# EAGLE design LCD_Rev-4 (EAGLE 6.4)
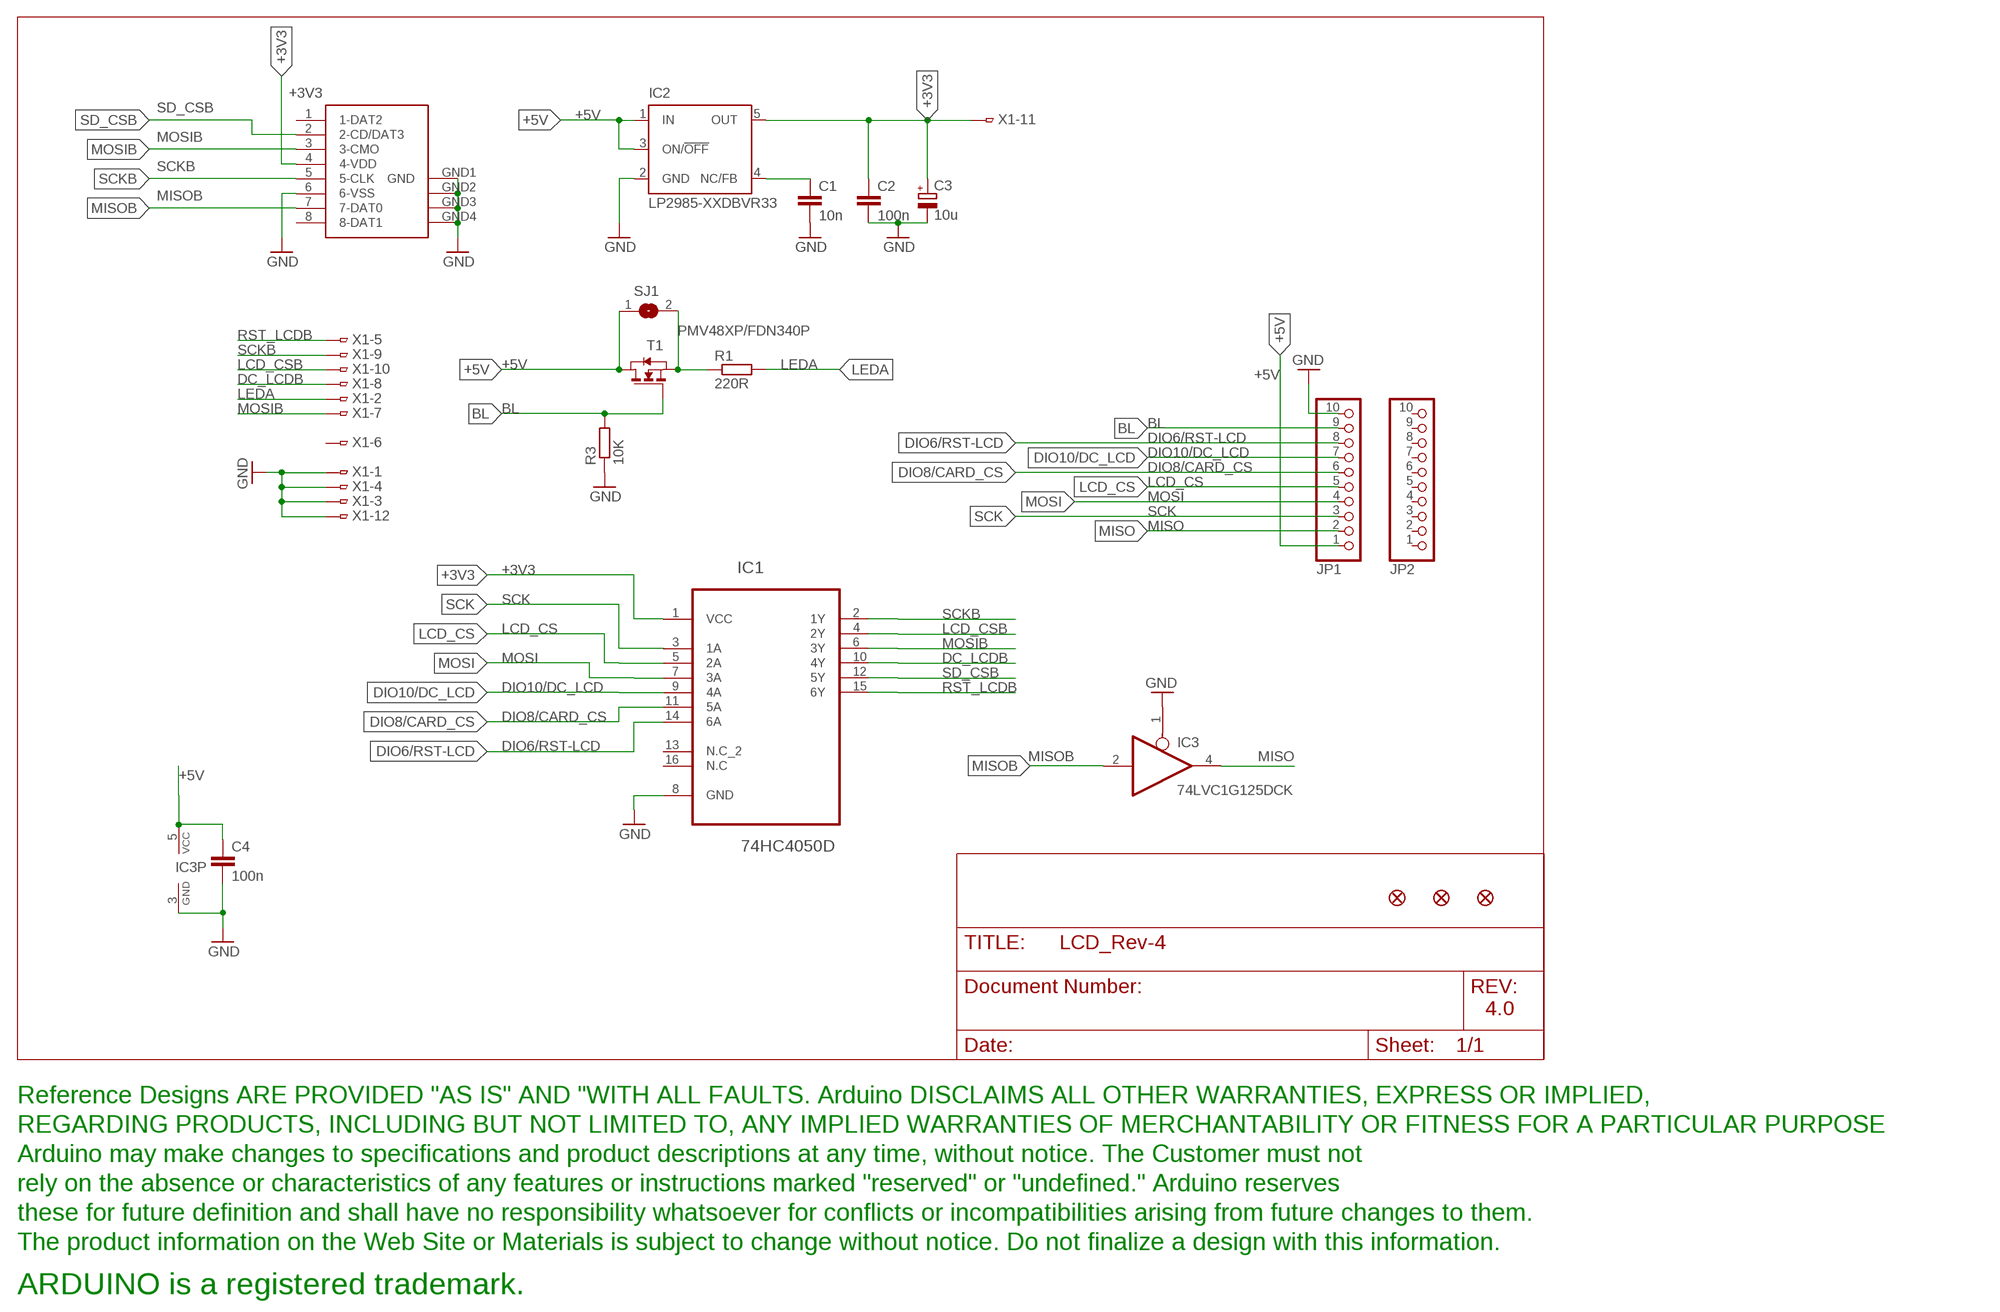
[diagram p0: schematic, sheet 1]

## Parts
C1  10n  C-EUC0603  [C0603-ROUND]
C2  100n  C-EUC0603  [C0603-ROUND]
C3  10u  CPOL-EUSMCB  [SMC_B]
C4  100n  C-EUC0603  [C0603-ROUND]
IC1  74HC4050D  [SOIC127P600X175-16N]
IC2  LP2985-XXDBVR33  [SOT23-DBV]
IC3  74LVC1G125DCK  [SC70-5]
JP1  PINHD-1X10TH  [1X10-TH]
JP2  PINHD-1X10TH  [1X10-TH]
R1  220R  R-EU_0603-RND  [R0603-ROUND]
R3  10K  R-EU_0603-RND  [R0603-ROUND]
SJ1  SJL  [SJL]
T1  PMV48XP/FDN340P  NMOSSOT23  [SOT-23]
U1  SDCARD-15TW-8821  [SDCARD-15TW-8821]
U$1  FIDUCIAL-LITTLE1X2  [FIDUCIAL-1X2]
U$2  DISCLAIMER  [DISCLAIMER]
U$3  FIDUCIAL-LITTLE1X2  [FIDUCIAL-1X2]
U$4  FIDUCIAL-LITTLE1X2  [FIDUCIAL-1X2]
X1  FH12-12S-0.8SH  [FH12-12S-0.8SH]

## Nets
+3V3: C2.1 C3.+ IC1.1(VCC) IC2.5(OUT) U1.4(4-VDD) X1.11
+5V: C4.1 IC2.1(IN) IC2.3(ON/!OFF) IC3.5(VCC) JP1.1 SJ1.1 T1.1(D)
BL: JP1.9 R3.2 T1.3(G)
DC_LCDB: IC1.10(4Y) X1.8
DIO6/RST-LCD: IC1.14(6A) JP1.8
DIO8/CARD_CS: IC1.11(5A) JP1.6
DIO10/DC_LCD: IC1.9(4A) JP1.7
GND: C1.2 C2.2 C3.- C4.2 IC1.8(GND) IC2.2(GND) IC3.1(OE) IC3.3(GND) JP1.10 R3.1 U1.6(6-VSS) U1.GND1(GND) U1.GND2(GND1) U1.GND3(GND2) U1.GND4(GND3) X1.1 X1.3 X1.4 X1.12
LCD_CS: IC1.5(2A) JP1.5
LCD_CSB: IC1.4(2Y) X1.10
LEDA: R1.2 X1.2
MISO: IC3.4(O) JP1.2
MISOB: IC3.2(I) U1.7(7-DAT0)
MOSI: IC1.7(3A) JP1.4
MOSIB: IC1.6(3Y) U1.3(3-CMO) X1.7
N$1: C1.1 IC2.4(NC/FB)
N$2: R1.1 SJ1.2 T1.2(S)
RST_LCDB: IC1.15(6Y) X1.5
SCK: IC1.3(1A) JP1.3
SCKB: IC1.2(1Y) U1.5(5-CLK) X1.9
SD_CSB: IC1.12(5Y) U1.2(2-CD/DAT3)
Unconnected: IC1.13(N.C_2) IC1.16(N.C) JP2.1 JP2.2 JP2.3 JP2.4 JP2.5 JP2.6 JP2.7 JP2.8 JP2.9 JP2.10 U1.1(1-DAT2) U1.8(8-DAT1) X1.6

## Notes on the sheet
- 4.0

## Library data of the parts
C1 C2 C4 = Smartprj:C-EU: CAPACITOR, European symbol
C3 = Smartprj:CPOL-EU: POLARIZED CAPACITOR, European symbol
IC1 = Smartprj:74HC4050D: Hex high-to-low level shifter; MPN: 74HC4050D; OC_FARNELL: 1085272; OC_NEWARK: -; PACKAGE: SOIC-16; SUPPLIER: NXP
IC2 = Smartprj:LP2985-XXDBVR: ULTRALOW-POWER 50-mA LOW-DROPOUT LINEAR REGULATORS 50-mA Low-Dropout Regulator Source: http://focus.ti.com/lit/ds/symlink/tps77001.pdf
IC3 = 74xx-little-us:74*1G125: Single Bus Buffer Gate with 3-State Output
JP1 JP2 = Smartprj:PINHD-1X10: PIN HEADER
R1 R3 = Smartprj:R-EU_: RESISTOR, European symbol
SJ1 = Smartprj:SJ: SMD solder JUMPER
T1 = zetex:NMOSSOT23: MOS FET; OC_FARNELL: unknown; OC_NEWARK: unknown
U1 = st-mod v1.4:SDCARD-15TW-8821: SD Card SDCARD 15TW 8821
U$1 U$3 U$4 = Smartprj:FIDUCIAL-LITTLE: Fiducial Alignment Points Various fiducial points for machine vision alignment.
U$2 = Smartprj:DISCLAIMER
X1 = Smartprj:FH12-12S-0.8S: 0.5mm Pitch Connectors For FPC/FFC Source: Data sheet <http://www.hirose.co.jp/cataloge_hp/e58605370.pdf>; MPN: MC34827; OC_FARNELL: 1324544; OC_NEWARK: 41P0493

## Board
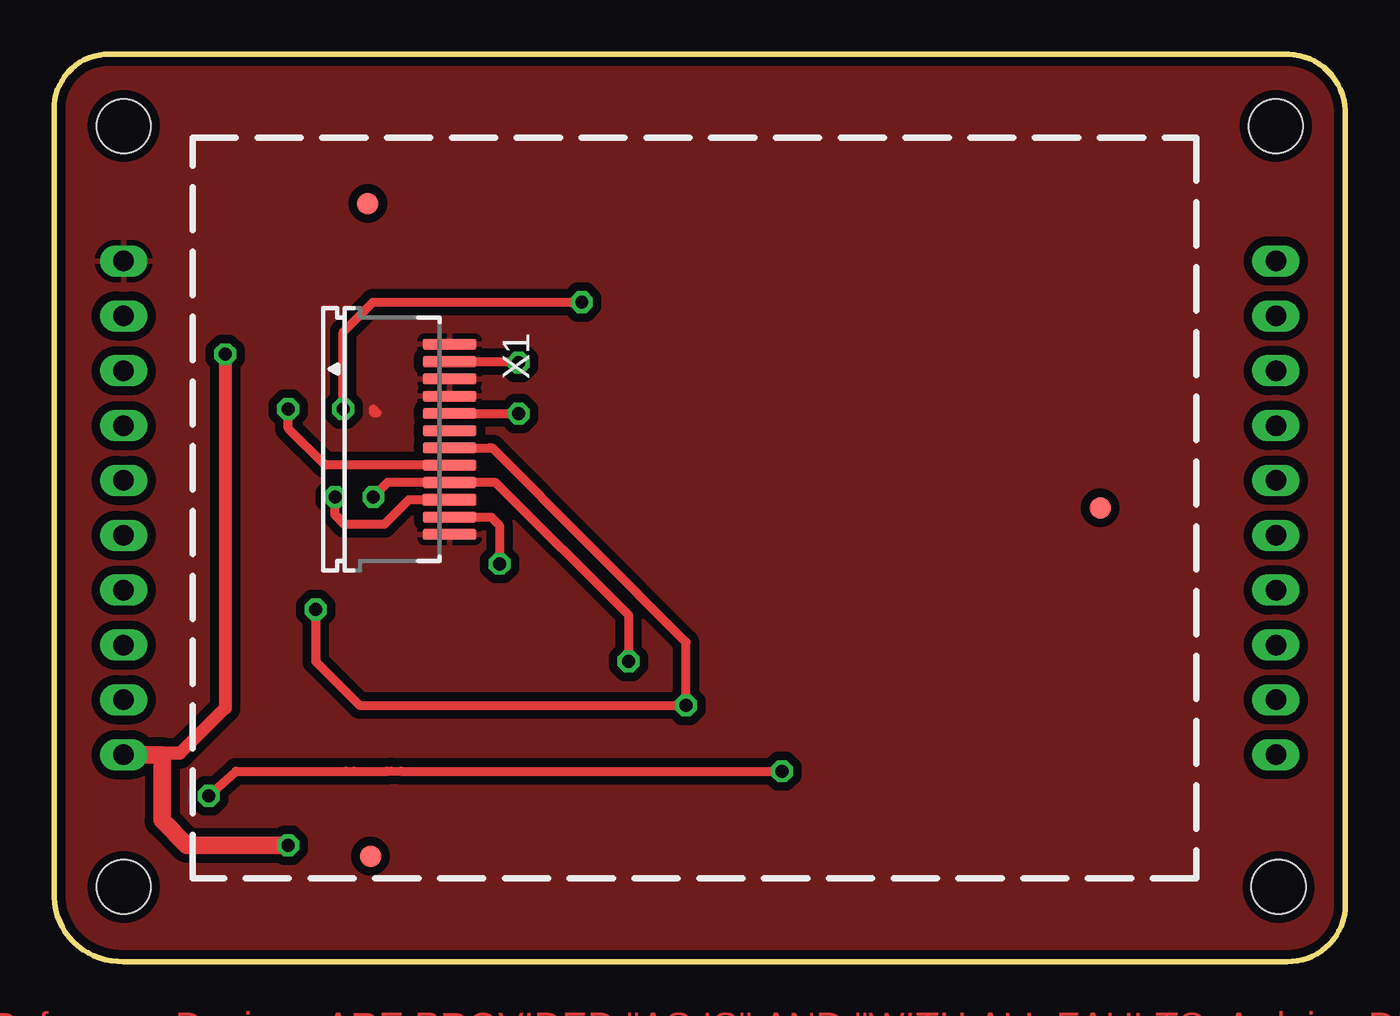
[diagram p1: board, top side]
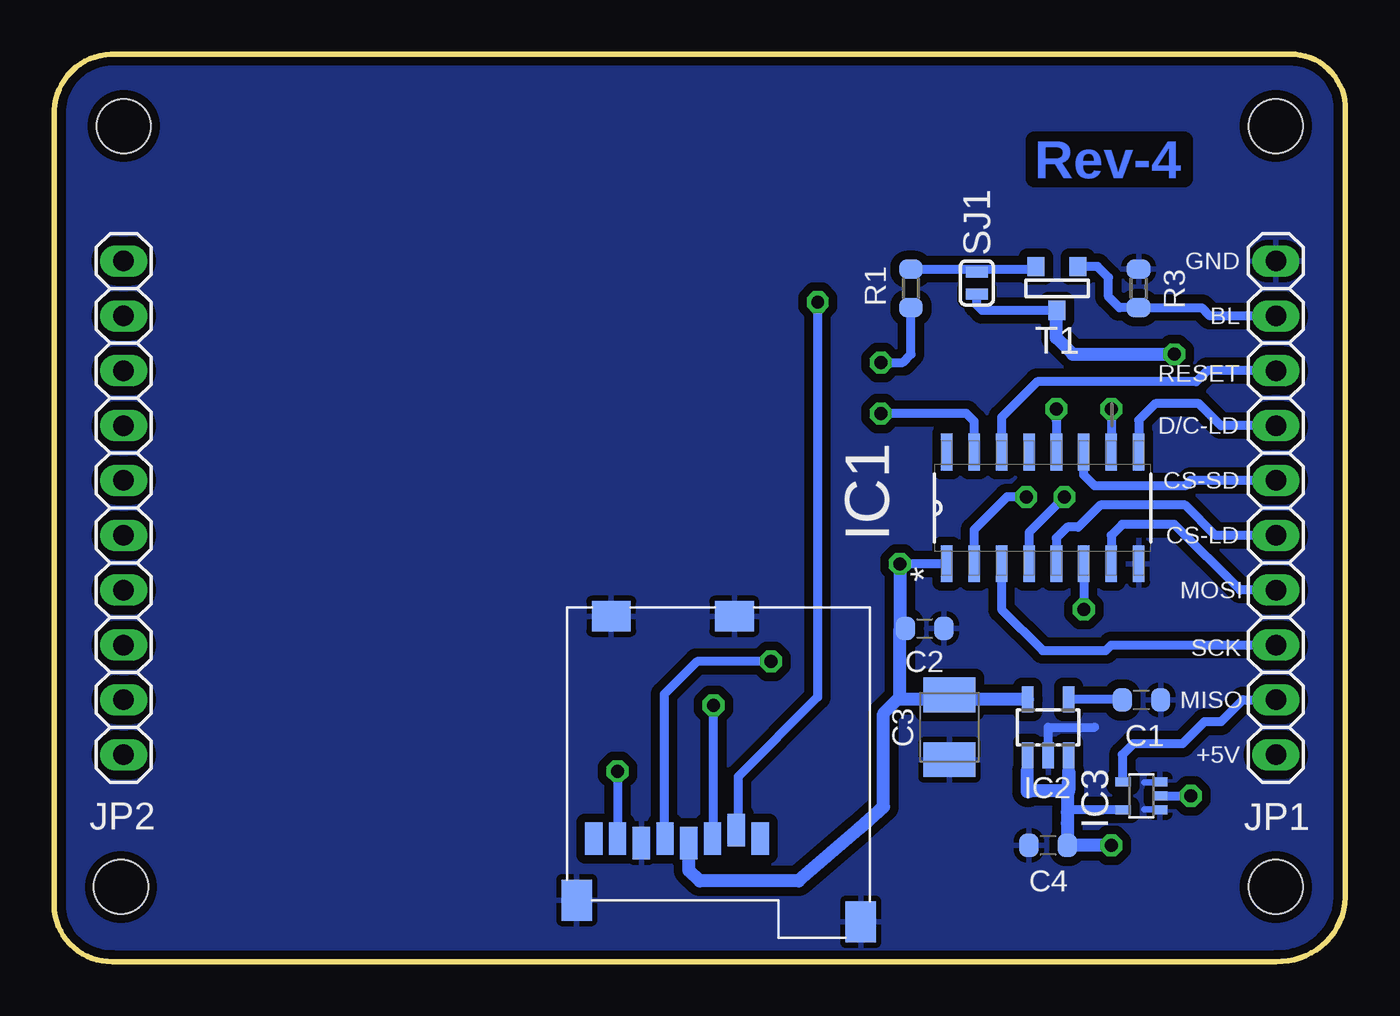
[diagram p2: board, bottom side, seen from below]

Size 59.79 x 42.02 mm. Coordinates in mm from the lower left corner, seen from the top.
Outline: 59.79,2.59 arc-90 57.07,0 3.23,0 arc-90 0,2.97 0,39.67 arc-90 2.79,42.01 56.9,42.01 arc-90 59.79,39.42 59.79,2.59
Copper layers (1*16): Top 0.035mm / dielectric 1.5mm / Bottom 0.035mm
Design rules "default": minimum track width 10mil, minimum drill 23mil, track to track 8mil, track to pad 8mil, pad to pad 8mil, via to via 8mil, smd to smd 8mil, copper to edge 8mil, drill to drill 8mil, minimum pad ring 10mil, minimum via ring 8mil, stop-mask expansion 4mil, vias tented up to drill 31mil, thermal gap 10mil
Holes 2.5 mm at 3.23,38.68 56.69,3.45 3.23,3.45 56.57,38.68

### Footprints (pad centres in the part's own frame; a part is rotated, then mirrored left to right if it is on the bottom)
C0603-ROUND = smd 0.898 x 1.1: 1 -0.889,0; 2 0.889,0
SMC_B = smd 1.6 x 2.4: + -1.5,0; - 1.5,0
SOIC127P600X175-16N = smd 1.702 x 0.533: 1 -2.591,4.445; 2 -2.591,3.175; 3 -2.591,1.905; 4 -2.591,0.635; 5 -2.591,-0.635; 6 -2.591,-1.905; 7 -2.591,-3.175; 8 -2.591,-4.445; 9 2.591,-4.445; 10 2.591,-3.175; 11 2.591,-1.905; 12 2.591,-0.635; 13 2.591,0.635; 14 2.591,1.905; 15 2.591,3.175; 16 2.591,4.445
SOT23-DBV = smd 0.55 x 1.2: 1 -0.95,-1.3; 2 0,-1.3; 3 0.95,-1.3; 4 0.95,1.3; 5 -0.95,1.3
SC70-5 = smd 0.4 x 0.7: 1 -0.65,-0.85; 2 0,-0.85; 3 0.65,-0.85; 4 0.65,0.85; 5 -0.65,0.85
1X10-TH = drill 0.95 pad 1.422 long: 1 -11.43,0; 2 -8.89,0; 3 -6.35,0; 4 -3.81,0; 5 -1.27,0; 6 1.27,0; 7 3.81,0; 8 6.35,0; 9 8.89,0; 10 11.43,0
R0603-ROUND = smd 0.898 x 1.1: 1 -0.889,0; 2 0.889,0
SJL = smd 0.508 x 1.016: 1 -0.508,0; 2 0.508,0
SOT-23 = smd 0.787 x 0.889: 1 0.025,-1.016; 2 -0.94,1.016; 3 0.991,1.016
SDCARD-15TW-8821 = smd 0.8 x 1.5: 1 0,0; 2 1.1,-0.4; 3 2.2,0; 4 3.3,0.2; 5 4.4,0; 6 5.5,0.2; 7 6.6,0; 8 7.7,0 | smd 1.4 x 1.9: GND1 -4.66,3.85; GND2 8.49,2.85 | smd 1.8 x 1.4: GND3 1.19,-10.3; GND4 6.89,-10.3
FIDUCIAL-1X2 = smd 1 x 1: 1 0,0
FH12-12S-0.8SH = smd 0.5 x 2.5: 1 -4.4,3.25; 2 -3.6,3.25; 3 -2.8,3.25; 4 -2,3.25; 5 -1.2,3.25; 6 -0.4,3.25; 7 0.4,3.25; 8 1.2,3.25; 9 2,3.25; 11 3.6,3.25; 12 4.4,3.25 | smd 0.55 x 2.5: 10 2.8,3.25

### Placement (x,y rotation side)
C1  9.45,12.12 0 bottom
C2  19.48,15.42 0 bottom
C3  18.34,10.85 270 bottom
C4  13.77,5.38 180 bottom
IC1  14.02,21.01 90 bottom
IC2  13.77,10.85 0 bottom
IC3  9.45,7.67 90 bottom
JP1  3.23,21.01 90 bottom
JP2  56.57,21.01 270 bottom
R1  20.12,31.17 270 bottom
R3  9.58,31.17 270 bottom
SJ1  17.07,31.42 90 bottom
T1  13.39,31.17 0 bottom
U1  27.1,5.69 180 bottom
U$1  14.53,35.1 0 top
U$2  -3,-21.79 0 top  (outside the outline)
U$3  14.66,4.88 0 top
U$4  48.44,21.01 0 top
X1  15.06,24.18 270 top

### Tracks (layer width: path | path; a pad name or v marks a point on that pad's centre or on a via)
+3V3  (via drill 0.6)
  Top 0.406: 20.63,18.39 20.62,18.4 | v20.63,18.42 v20.62,18.41 20.62,20.19 20.24,20.58 X1.11
  Top 0.61: v20.62,18.41 20.62,18.4
  Bottom 0.406: 17.58,12.12 17.7,12.24 17.96,12.24 17.96,12.12 17.73,12.35 C3.+ 17.9,12.15 19.74,12.15 | 15.54,12.12 15.54,12.15 | IC1.1 v20.62,18.41
  Bottom 0.61: IC2.5 15.54,12.15 19.74,12.15 20.62,12.15 20.62,12.24 | U1.4 30.4,4.22 29.9,3.73 25.32,3.73 22.53,6.15 21.39,7.16 21.39,11.48 20.62,12.24 | v20.62,18.41 20.62,15.42 | 20.62,12.24 20.62,15.42 | C2.1 20.62,15.42
+5V  (via drill 0.6)
  Top 0.61: v7.92,28.12 7.92,11.73 5.83,9.64 4.94,9.64 4.88,9.58
  Top 0.813: v10.85,5.38 6.15,5.38 5,6.53 5,9.58 4.88,9.58 JP1.1
  Bottom 0.406: T1.1 13.39,30.15 16.81,30.15 17.07,30.4 SJ1.1 | 12.81,7.86 14.66,7.92 | IC2.3 12.83,9.65 12.83,7.92 | 14.73,8.84 IC2.1 | C4.1 12.84,5.26 | IC3.5 11.24,7.02 12.88,7.02 12.88,6.91
  Bottom 0.61: v7.92,28.12 12.62,28.12 13.39,28.88 13.39,30.15 | 12.83,7.92 14.66,7.92 14.66,7.86 14.73,7.86 14.73,8.84 | 12.83,7.92 12.82,7.92 12.82,8.81 12.83,7.92 | v10.85,5.38 C4.1 12.88,6.4 12.88,6.91 12.88,7.86 12.81,7.86
BL
  Bottom 0.406: JP1.9 6.27,29.9 6.65,30.28 R3.2 10.46,30.28 10.97,30.78 10.97,31.67 11.48,32.18 T1.3
DC_LCDB  (via drill 0.6)
  Top 0.406: v10.85,25.58 10.85,24.69 12.55,22.99 13.44,22.98 X1.8
  Bottom 0.406: v10.85,25.58 IC1.10 10.85,23.55
DIO6/RST-LCD
  Bottom 0.406: JP1.8 6.4,27.36 6.91,26.85 14.27,26.85 15.93,25.2 IC1.14 15.93,23.55
DIO8/CARD_CS
  Bottom 0.406: JP1.6 7.16,22.28 7.42,22.02 11.61,22.02 12.12,22.53 IC1.11
DIO10/DC_LCD
  Bottom 0.406: JP1.7 5.77,24.82 6.78,25.83 8.81,25.83 9.58,25.07 IC1.9
GND
  Top 0.406: 14.95,25.41 14.78,25.58 | 14.83,25.41 14.78,25.45
  Bottom 0.305: 8.56,8.31 9.32,8.31 | 8.56,7.04 9.32,7.04
  Bottom 0.406: IC2.2 13.77,10.85 11.61,10.85
  pour Bottom (isolate 0.406): -0.08,43.23 60.13,42.93 60.25,-1.77 0.05,-1.47
  pour Top (isolate 0.406): -0.46,-0.84 -0.46,42.72 60.66,42.57 60.56,-0.74
LCD_CS
  Bottom 0.406: JP1.5 6.02,19.74 7.42,21.13 11.35,21.13 12.37,20.12 12.88,20.12 13.39,19.61 IC1.5 13.39,18.34
LCD_CSB  (via drill 0.6)
  Top 0.406: v13,21.51 13,20.69 13.45,20.24 15.29,20.24 16.43,21.38 X1.10
  Bottom 0.406: v13,21.51 14.66,19.86 IC1.4 14.66,18.34
LEDA  (via drill 0.6)
  Top 0.406: X1.2 21.47,27.78 v21.51,27.74
  Bottom 0.406: v21.51,27.74 20.5,27.74 20.12,28.12 R1.2
MISO
  Bottom 0.406: JP1.2 4.75,12.12 5.77,11.1 6.53,11.1 7.54,10.08 9.83,10.08 10.34,9.58 10.34,8.36 IC3.4
MISOB  (via drill 0.6)
  Top 0.406: v7.16,7.67 8.43,8.81 13.51,8.81 13.89,8.81 15.42,8.81 15.61,8.82 16.06,8.81 v33.71,8.81
  Bottom 0.406: IC3.2 v7.16,7.67 | v33.71,8.81 U1.7
MOSI
  Bottom 0.406: JP1.4 4.88,17.2 7.92,20.24 10.34,20.24 10.85,19.74 IC1.7
MOSIB  (via drill 0.6)
  Top 0.406: v29.26,11.86 14.15,11.86 12.12,13.89 v12.12,16.31 | v29.26,11.86 29.2,11.99 29.26,12.18 | v29.26,11.86 29.26,12.18 | 29.26,12.18 29.26,14.78 20.29,23.77 20.15,23.77 20.15,23.78 X1.7
  Bottom 0.406: U1.3 29.26,5.69 v29.26,11.86 | IC1.6 v12.12,16.31
N$1
  Bottom 0.406: IC2.4 10.72,12.15 C1.1
N$2
  Bottom 0.406: R1.1 16.18,32.05 | 16.18,32.05 14.53,32.05 14.4,32.18 T1.2 | SJ1.2 17.2,31.93 17.2,32.05 16.18,32.05
RST_LCDB  (via drill 0.6)
  Top 0.406: X1.5 18.26,25.38 18.26,25.37 18.29,25.37 | X1.5 17.89,25.38 17.88,25.37 18.24,25.37 | 17.83,25.37 18.18,25.37 | 18.18,25.37 X1.5 | 18.18,25.37 v21.51,25.37
  Bottom 0.406: IC1.15 17.2,25.02 17.55,25.37 v21.51,25.37 17.83,25.37
SCK
  Bottom 0.406: JP1.3 10.85,14.66 11.1,14.4 14.02,14.4 15.93,16.31 IC1.3
SCKB  (via drill 0.6)
  Top 0.406: v14.78,21.51 15.45,22.18 X1.9 18.17,22.17 20.45,22.17 26.59,16.05 v26.59,13.89
  Bottom 0.406: v26.59,13.89 30.02,13.89 31.55,12.37 31.55,5.73 U1.5 | v14.78,21.51 15.67,21.51 17.2,19.99 IC1.2
SD_CSB  (via drill 0.6)
  Top 0.406: v13.39,25.58 13.36,25.58 13.39,25.56 v13.39,25.58 | v13.39,25.58 13.39,29.15 14.77,30.53 v24.43,30.53
  Bottom 0.406: v24.43,30.53 24.43,12.24 28.12,8.56 28.12,6.13 U1.2 | v13.39,25.58 v13.38,25.58 13.39,25.07 IC1.12

### Text on the board
Bottom: Rev-4
bNames: GND | BL | RESET | D/C-LD | CS-SD | CS-LD | MOSI | SCK | MISO | +5V